# Altium schematic sheet 3V3_BUCK.SchDoc
size A
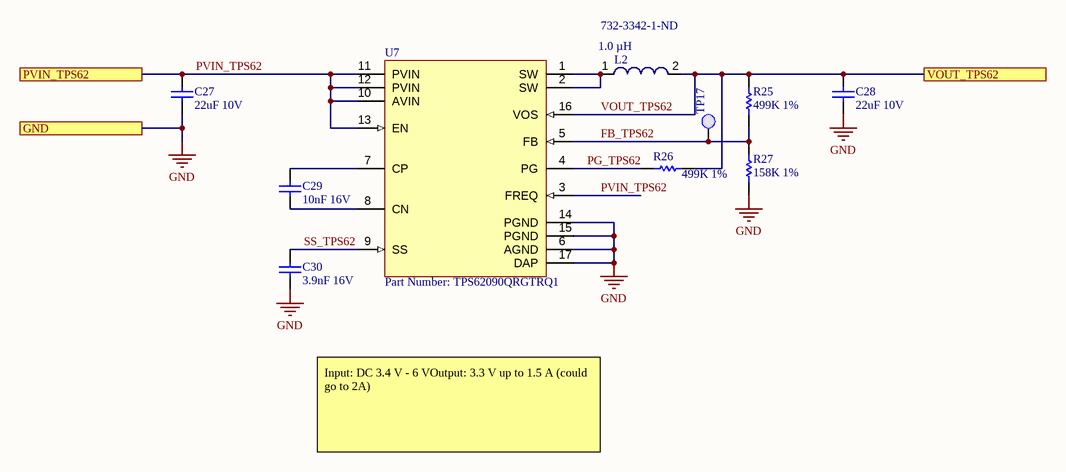
[diagram p0: 3V3_BUCK.SchDoc]

## Parts
C27  22uF 10V  [CAPC0805(2012)145_N]
C28  22uF 10V  [CAPC0805(2012)145_N]
C29  10nF 16V  [CAPC0603(1608)100_N]
C30  3.9nF 16V  [CAPC0603(1608)100_N]
L2  Inductance: 1.0 µH  Supplier Part Number 1: 732-3342-1-ND  [WE-LHMI 4020]  (hidden comment: 74437324010)
R25  499K 1%  [RESC0603(1608)_L]
R26  499K 1%  [RESC0603(1608)_L]
R27  158K 1%  [RESC0603(1608)_N]
TP17  0.1" Pad  [PCBComponent]  (value not drawn)
U7  Part Number: TPS62090QRGTRQ1  [QFN50P300X300X100_HS-17N]

## Ports
GND, PVIN_TPS62, VOUT_TPS62

## Nets
GND: C27.1 C28.1 C30.1 R27.1 U7.6(AGND) U7.14(PGND) U7.15(PGND) U7.17(DAP) ; port GND
FB_TPS62: R25.1 R27.2 TP17.1(PAD) U7.5(FB)
PG_TPS62: R26.2 U7.4(PG)
PVIN_TPS62: C27.2 U7.3(FREQ) U7.10(AVIN) U7.11(PVIN) U7.12(PVIN) U7.13(EN) ; port PVIN_TPS62
SS_TPS62: C30.2 U7.9(SS)
VOUT_TPS62: C28.2 L2.2 R25.2 R26.1 U7.16(VOS) ; port VOUT_TPS62
NetC29_1: C29.1 U7.8(CN)
NetC29_2: C29.2 U7.7(CP)
NetL2_1: L2.1 U7.1(SW) U7.2(SW)

## Notes on the sheet
- Input: DC 3.4 V - 6 VOutput: 3.3 V up to 1.5 A (could go to 2A)
- DWG. NO.
- REV.
- SHT.
- THIS DOCUMENT AND THE DATA DISCLOSED HEREIN OR HEREWITH IS THE PROPERTY OF ALTIUM LIMITED AND MAY BE FREELY DISTRIBUTED IN WHOLE. NO RIGHTS ARE RESERVED OR EXPRESS OR IMPLIED WARANTEE GIVEN.
- REVISION
- DESCRIPTION
- DATE
- APPROVED
- ENG:
- APPROVALS
- PROJECT
- DSN:
- CHK:
- REFERENCE DOCUMENTS
- PROJECT REVISION:
- TITLE
- DOCUMENT REVISION:
- DESIGN ITEM:
- BOM:
- FAB DWG:
- PCB DWG:
- ASSY DWG:
- SCALE:
- SIZE
- B
- CAGE CODE
- FILE NAME
- DWG NO.
- SHEET
- OF
- REV

## Library data of the parts
C27 C28 = CMP-1036-04943-1: CAP 22uF 10V ±20% 0805 (2012 Metric) Thickness 1.45mm SMD; Case-Metric: 2012; Case-EIA: 0805; Tolerance: Â±20%; Rated Voltage: 10 V; Max Thickness: 1.45 mm; Technology: SMT; Value: 22uF
C29 = CMP-1035-02311-1: CAP 10nF 16V ±10% 0603 (1608 Metric) Thickness 1mm SMD; Case-EIA: 0603; Case-Metric: 1608; Tolerance: Â±10%; Rated Voltage: 16 V; Value: 10nF; Max Thickness: 1 mm; Technology: SMT
C30 = CMP-1035-02154-1: CAP 3.9nF 16V ±10% 0603 (1608 Metric) Thickness 1mm SMD; Tolerance: Â±10%; Case-Metric: 1608; Case-EIA: 0603; Max Thickness: 1 mm; Technology: SMT; Value: 3.9nF; Rated Voltage: 16 V
L2 = CMP-1353-00030-1: SMD Power Inductor WE-LHMI, L=1.0 µH; Manufacturer: Wuerth Elektronik; Core Material: Ferrite,Composite; Tolerance: 20%; Current Rating: 5A; Saturation Current: 9A; Shielding: Shielded; Frequency: 89MHz; DC Resistance (DCR): 27mR; Test Frequency: 100kHz; ComponentLink1Description: Manufacturer URL; ComponentLink2URL: http://katalog.we-online.de/kataloge/eisos/media/pdf/74437324010.pdf; PartNumber: 74437324010; ComponentLink1URL: http://www.we-online.com; ComponentLink2Description: Datasheet; PackageReference: WE-LHMI 4020; Supplier 1: Digi-Key; Manufacturer Part Number: 74437324010; Stock 1: 1150; Pricing 1: 1=2.20000, 10=2.15000, 50=1.97100, 100=1.88200, 500=1.79200, 1000=1.70200 (USD); RoHS: Yes; Mount: Surface Mount; Case/Package: Nonstandard; Min Operating Temperature: -40°C; Max Operating Temperature: 125°C; Package Quantity: 1; Packaging: Tape and Reel; Self Resonant Frequency: 89MHz; Inductance Tolerance: 20%; Composition: Wirewound; Max DC Current: 5A; Termination: SMD/SMT; RMS Current (Irms): 5A; Series Resistance: 27mR; Length: 4.45mm; Height: 1.8mm; Width: 4.06mm; Height - Seated (Max): 0.079inch; Depth: 4.06mm; REACH SVHC: Unknown; ComponentLink3URL: https://datasheet.ciiva.com/25608/0900766b810c01e4-25608161.pdf?src-supplier=RSComponents; ComponentLink3Description: https://datasheet.ciiva.com/25608/0900766b810c01e4-25608161.pdf?src-supplier=RSComponents; ComponentLink4URL: https://datasheet.ciiva.com/1052/74437324010-1052167.pdf?src-supplier=Digi-Key; ComponentLink4Description: https://datasheet.ciiva.com/1052/74437324010-1052167.pdf?src-supplier=Digi-Key; ComponentLink5URL: https://datasheet.ciiva.com/4961/74437324010-55268-4961274.pdf?src-supplier=Mouser; ComponentLink5Description: https://datasheet.ciiva.com/4961/74437324010-55268-4961274.pdf?src-supplier=Mouser; ComponentLink6URL: https://datasheet.ciiva.com/7892/1735821-7892716.pdf?src-supplier=Element14; ComponentLink6Description: https://datasheet.ciiva.com/7892/1735821-7892716.pdf?src-supplier=Element14; ComponentLink7URL: https://datasheet.ciiva.com/1052/74437324010-1052168.pdf?src-supplier=Digi-Key; ComponentLink7Description: https://datasheet.ciiva.com/1052/74437324010-1052168.pdf?src-supplier=Digi-Key; ComponentLink8URL: https://datasheet.ciiva.com/1052/74437324010-1052169.pdf?src-supplier=Digi-Key; ComponentLink8Description: https://datasheet.ciiva.com/1052/74437324010-1052169.pdf?src-supplier=Digi-Key
R25 R26 = CMP-1012-00815-1: 499K 0.1W 1% 0603 (1608 Metric)  SMD; Value: 499000.00 Ohm; Case-Metric: 1608; Case-EIA: 0603; Tolerance: 1 %; Technology: SMT; Power: 0.1 W
R27 = CMP-1012-00756-1: 158K 0.1W 1% 0603 (1608 Metric)  SMD; Value: 158000.00 Ohm; Case-Metric: 1608; Case-EIA: 0603; Tolerance: 1 %; Technology: SMT; Power: 0.1 W
TP17 = 0.1" Pad-A.4
U7 = TPS62090QRGTRQ1: No Description Available; Vendor: Texas Instruments; Built_By: Texas_Instrument_Team; CompType: IC; Manufacturer_Part_Number: TPS62090QRGTRQ1; Copyright: Copyright (C) 2018 Accelerated Designs. All rights reserved; RefDes: RefDes; Type: DEV; Value: Value; PartNumber: TPS62090QRGTRQ1; PackageReference: RGT0016C; MountType: SMT; RoHS: Y; Manufacturer: Texas Instruments